# EAGLE design tulip breakout (EAGLE 9.6.2)
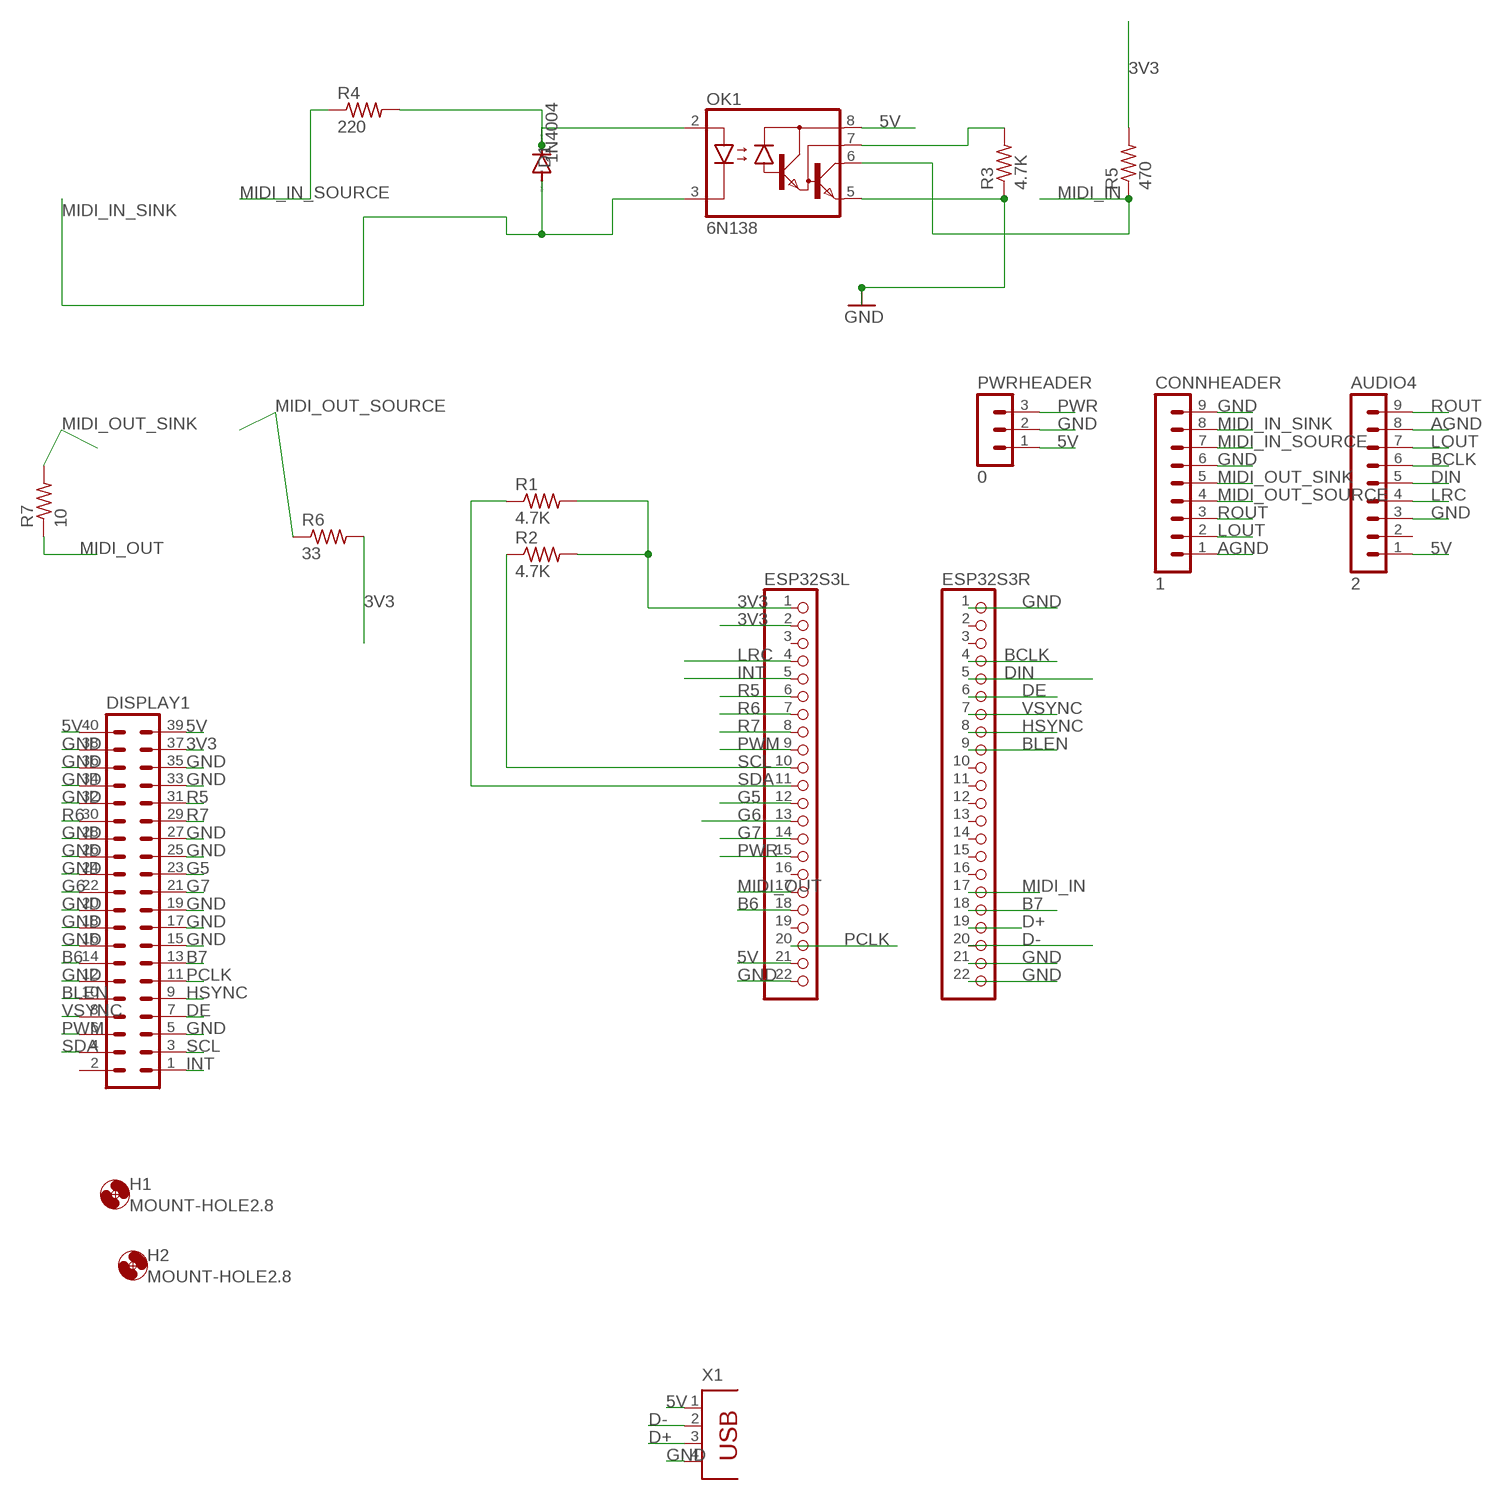
[diagram p0: schematic, sheet 1]

## Parts
AUDIO4  2  MA09-1  [MA09-1]
CONNHEADER  1  MA09-1  [MA09-1]
D1  1N4004  [DO41-10]
DISPLAY1  MA20-2  [MA20-2]
ESP32S3L  PINHD-1X22  [1X22]
ESP32S3R  PINHD-1X22  [1X22]
H1  MOUNT-HOLE2.8  [2,8]
H2  MOUNT-HOLE2.8  [2,8]
OK1  6N138  [DIL08]
PWRHEADER  0  MA03-1  [MA03-1]
R1  4.7K  R-US_0207/12  [0207/12]
R2  4.7K  R-US_0207/12  [0207/12]
R3  4.7K  R-US_0207/12  [0207/12]
R4  220  R-US_0207/12  [0207/12]
R5  470  R-US_0207/12  [0207/12]
R6  33  R-US_0207/12  [0207/12]
R7  10  R-US_0207/12  [0207/12]
X1  PN87520  [PN87520]

## Nets
3V3: DISPLAY1.37 ESP32S3L.1 ESP32S3L.2 R1.2 R2.2 R5.2 R6.2
5V: AUDIO4.1 DISPLAY1.39 DISPLAY1.40 ESP32S3L.21 OK1.8(VCC) PWRHEADER.1 X1.1
AGND: AUDIO4.8 CONNHEADER.1
B6: DISPLAY1.14 ESP32S3L.18
B7: DISPLAY1.13 ESP32S3R.18
BCLK: AUDIO4.6 ESP32S3R.4
BLEN: DISPLAY1.10 ESP32S3R.9
D+: ESP32S3R.19 X1.3
D-: ESP32S3R.20 X1.2
DE: DISPLAY1.7 ESP32S3R.6
DIN: AUDIO4.5 ESP32S3R.5
G5: DISPLAY1.23 ESP32S3L.12
G6: DISPLAY1.22 ESP32S3L.13
G7: DISPLAY1.21 ESP32S3L.14
GND: AUDIO4.3 CONNHEADER.6 CONNHEADER.9 DISPLAY1.5 DISPLAY1.12 DISPLAY1.15 DISPLAY1.16 DISPLAY1.17 DISPLAY1.18 DISPLAY1.19 DISPLAY1.20 DISPLAY1.24 DISPLAY1.25 DISPLAY1.26 DISPLAY1.27 DISPLAY1.28 DISPLAY1.32 DISPLAY1.33 DISPLAY1.34 DISPLAY1.35 DISPLAY1.36 DISPLAY1.38 ESP32S3L.22 ESP32S3R.1 ESP32S3R.21 ESP32S3R.22 OK1.5(GND) PWRHEADER.2 R3.1 X1.4
HSYNC: DISPLAY1.9 ESP32S3R.8
INT: DISPLAY1.1 ESP32S3L.5
LOUT: AUDIO4.7 CONNHEADER.2
LRC: AUDIO4.4 ESP32S3L.4
MIDI_IN: ESP32S3R.17 OK1.6(VO) R5.1
MIDI_IN_SINK: CONNHEADER.8 D1.A OK1.3(C)
MIDI_IN_SOURCE: CONNHEADER.7 R4.1
MIDI_OUT: ESP32S3L.17 R7.1
MIDI_OUT_SINK: CONNHEADER.5 R7.2
MIDI_OUT_SOURCE: CONNHEADER.4 R6.1
N$30: D1.C OK1.2(A) R4.2
N$32: OK1.7(VB) R3.2
PCLK: DISPLAY1.11 ESP32S3L.20
PWM: DISPLAY1.6 ESP32S3L.9
PWR: ESP32S3L.15 PWRHEADER.3
R5: DISPLAY1.31 ESP32S3L.6
R6: DISPLAY1.30 ESP32S3L.7
R7: DISPLAY1.29 ESP32S3L.8
ROUT: AUDIO4.9 CONNHEADER.3
SCL: DISPLAY1.3 ESP32S3L.10 R2.1
SDA: DISPLAY1.4 ESP32S3L.11 R1.1
VSYNC: DISPLAY1.8 ESP32S3R.7
Unconnected: AUDIO4.2 DISPLAY1.2 ESP32S3L.3 ESP32S3L.16 ESP32S3L.19 ESP32S3R.2 ESP32S3R.3 ESP32S3R.10 ESP32S3R.11 ESP32S3R.12 ESP32S3R.13 ESP32S3R.14 ESP32S3R.15 ESP32S3R.16

## Library data of the parts
AUDIO4 CONNHEADER = con-lstb:MA09-1: PIN HEADER; OC_FARNELL: unknown; OC_NEWARK: unknown
D1 = diode:1N4004: DIODE general purpose rectifier, 1 A
DISPLAY1 = con-lstb:MA20-2: PIN HEADER; OC_FARNELL: unknown; OC_NEWARK: unknown
ESP32S3L ESP32S3R = pinhead:PINHD-1X22: PIN HEADER
H1 H2 = holes:MOUNT-HOLE: MOUNTING HOLE with drill center marker
OK1 = optocoupler:6N138: MOTOROLA OPTO COUPLER; MF: VISHAY/TELEFUNKEN; MPN: 6N138; OC_FARNELL: 9860150; OC_NEWARK: 35K5294
PWRHEADER = con-lstb:MA03-1: PIN HEADER; OC_FARNELL: unknown; OC_NEWARK: unknown
R1-R7 = rcl:R-US_: RESISTOR, American symbol; SPICEPREFIX: R
X1 = con-berg:PN87520: BERG USB connector; OC_FARNELL: unknown; OC_NEWARK: unknown

## Board
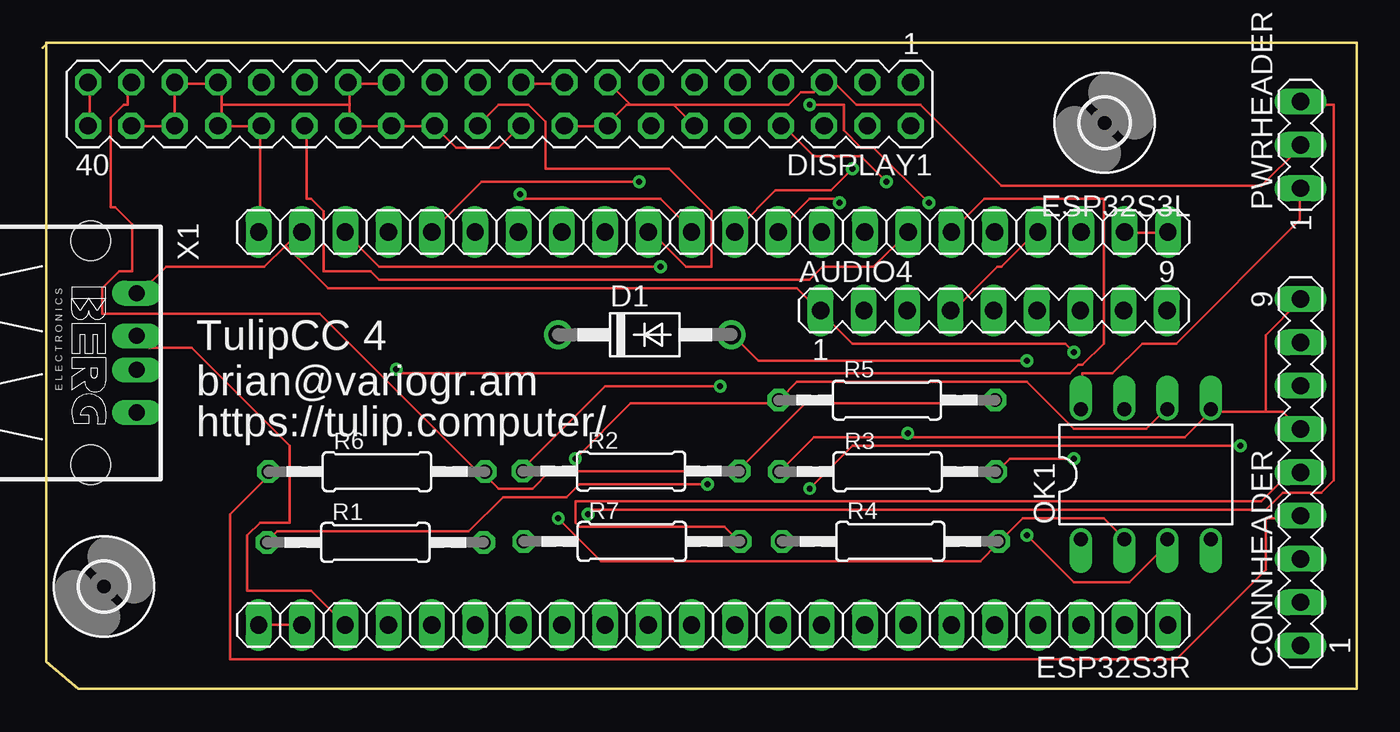
[diagram p1: board, top side]
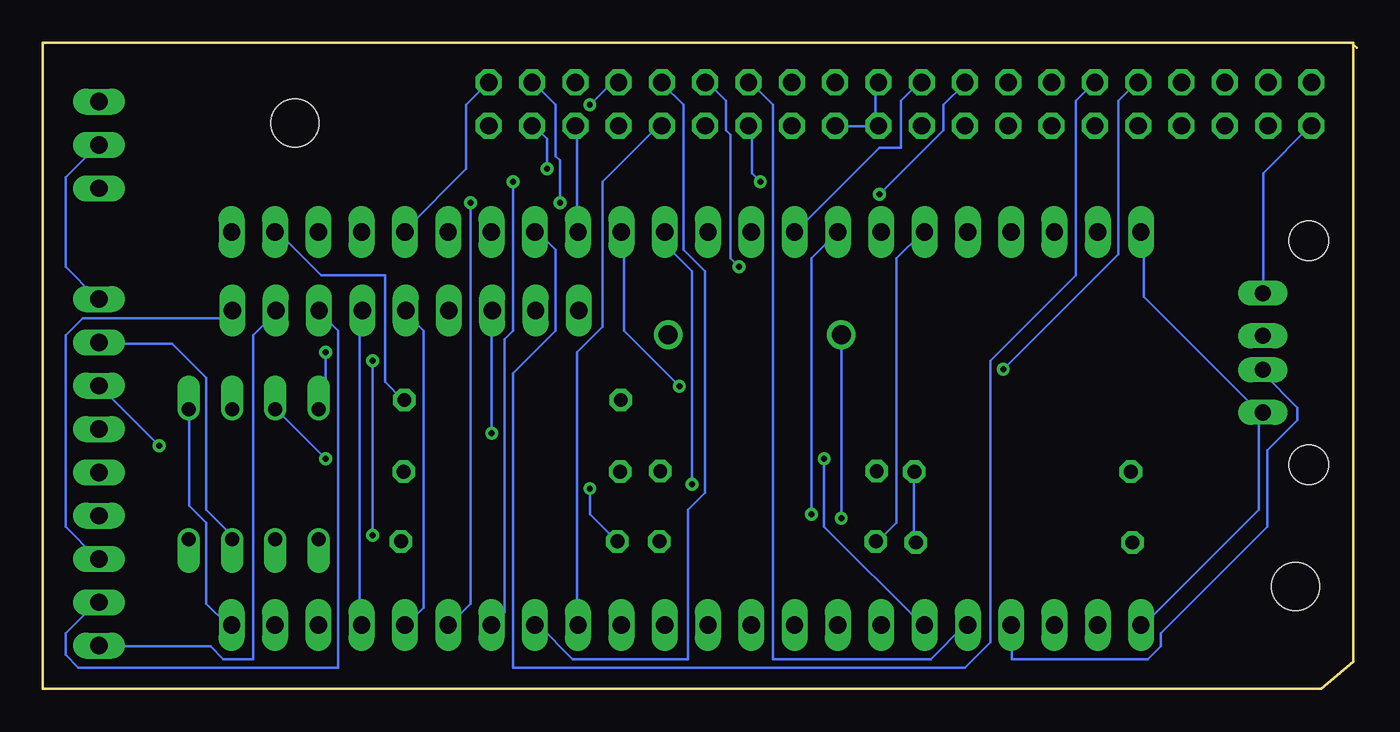
[diagram p2: board, bottom side, seen from below]

Size 77.1 x 37.9 mm. Coordinates in mm from the lower left corner, seen from the top.
Outline: 0.2,37.9 0.2,1.6 2.1,0 77.1,0 77.1,37.9 0.3,37.9 0,37.6
Copper layers (1*16): Top 0.035mm / dielectric 0.15mm / Bottom 0.035mm
Design rules "default *": minimum track width 6mil, minimum drill 0.35mm, track to track 10mil, track to pad 10mil, pad to pad 10mil, via to via 10mil, smd to smd 10mil, copper to edge 40mil, drill to drill 6mil, minimum pad ring 10mil, minimum via ring 8mil, stop-mask expansion 4mil, vias tented up to drill 0mil, thermal gap 10mil

### Footprints (pad centres in the part's own frame; a part is rotated, then mirrored left to right if it is on the bottom)
MA09-1 = drill 1.016 long: 1 -10.16,0; 2 -7.62,0; 3 -5.08,0; 4 -2.54,0; 5 0,0; 6 2.54,0; 7 5.08,0; 8 7.62,0; 9 10.16,0
DO41-10 = drill 1.118: A 5.08,0; C -5.08,0
MA20-2 = drill 1.016 octagon: 1 -24.13,-1.27; 2 -24.13,1.27; 3 -21.59,-1.27; 4 -21.59,1.27; 5 -19.05,-1.27; 6 -19.05,1.27; 7 -16.51,-1.27; 8 -16.51,1.27; 9 -13.97,-1.27; 10 -13.97,1.27; 11 -11.43,-1.27; 12 -11.43,1.27; 13 -8.89,-1.27; 14 -8.89,1.27; 15 -6.35,-1.27; 16 -6.35,1.27; 17 -3.81,-1.27; 18 -3.81,1.27; 19 -1.27,-1.27; 20 -1.27,1.27; 21 1.27,-1.27; 22 1.27,1.27; 23 3.81,-1.27; 24 3.81,1.27; 25 6.35,-1.27; 26 6.35,1.27; 27 8.89,-1.27; 28 8.89,1.27; 29 11.43,-1.27; 30 11.43,1.27; 31 13.97,-1.27; 32 13.97,1.27; 33 16.51,-1.27; 34 16.51,1.27; 35 19.05,-1.27; 36 19.05,1.27; 37 21.59,-1.27; 38 21.59,1.27; 39 24.13,-1.27; 40 24.13,1.27
1X22 = drill 1.016 long: 1 -26.67,0; 2 -24.13,0; 3 -21.59,0; 4 -19.05,0; 5 -16.51,0; 6 -13.97,0; 7 -11.43,0; 8 -8.89,0; 9 -6.35,0; 10 -3.81,0; 11 -1.27,0; 12 1.27,0; 13 3.81,0; 14 6.35,0; 15 8.89,0; 16 11.43,0; 17 13.97,0; 18 16.51,0; 19 19.05,0; 20 21.59,0; 21 24.13,0; 22 26.67,0
2,8 = hole 2.8: 0,0
DIL08 = drill 0.813 offset: 1 -3.81,-3.81; 2 -1.27,-3.81; 3 1.27,-3.81; 4 3.81,-3.81; 5 3.81,3.81; 6 1.27,3.81; 7 -1.27,3.81; 8 -3.81,3.81
MA03-1 = drill 1.016 long: 1 -2.54,0; 2 0,0; 3 2.54,0
0207/12 = drill 0.813 octagon: 1 -6.35,0; 2 6.35,0
PN87520 = drill 0.95 long: 1 -3.5,2.71; 2 -1,2.71; 3 1,2.71; 4 3.5,2.71 | hole 2.3: -6.57,0; 6.57,0

### Placement (x,y rotation side)
AUDIO4  55.8,22.2 0 top
CONNHEADER  73.8,12.7 90 top
D1  35.32,20.77 0 top
DISPLAY1  26.8,34.3 180 top
ESP32S3L  39.34,26.8 180 top
ESP32S3R  39.34,3.75 180 top
H1  3.6,6 0 top
H2  62.3,33.2 0 top
OK1  64.72,12.58 0 top
PWRHEADER  73.8,31.9 90 top
R1  19.52,8.59 0 top
R2  34.52,12.77 0 top
R3  49.57,12.74 0 top
R4  49.73,8.65 0 top
R5  49.53,16.94 0 top
R6  19.61,12.74 0 top
R7  34.57,8.65 0 top
X1  2.81,19.71 270 top

### Tracks (layer width: path | path; a pad name or v marks a point on that pad's centre or on a via)
3V3
  Top 0.152: ESP32S3L.2 63.5,26.75 66,26.75 ESP32S3L.1 | R5.2 55.75,16.75 44.75,16.75 41,13 R2.2 40.75,12.75 29.75,12.75 28.75,11.75 26.75,11.75 26,12.5 R6.2 25.75,12.75 25.5,12.75 16.25,22 3.5,22 3.5,23.5 4.5,24.5 5.25,24.5 5.25,27.25 4.25,28.25 4,28.25 4,33.5 4.75,34.25 5,34.25 5,35.5 DISPLAY1.37
  Bottom 0.152: ESP32S3L.2 63.25,26.75 60.75,24.25 57,24.25 57,18 56,17 R5.2 | R1.2 26,8.75 26,12.5 R6.2
5V  (via drill 0.35)
  Top 0.152: OK1.8 61,16.5 61,18.5 62.75,18.5 64.5,20.25 66.5,20.25 73.75,27.5 73.75,29.25 PWRHEADER.1 | DISPLAY1.40 2.75,33.25 2.75,35.5 DISPLAY1.39 | 14.25,26 15,26.75 ESP32S3L.21 | 14.25,26 13,24.75 7.25,24.75 5.75,23.25 X1.1 | 14.25,26 16.75,23.5 44.25,23.5 45.5,22.25 AUDIO4.1 45.75,22 47.5,20.25 60,20.25 v60.5,19.75
  Bottom 0.152: DISPLAY1.40 2.75,33 5.5,30.25 5.5,23.25 X1.1 | v60.5,19.75 60.5,16.75 60.75,16.5 OK1.8
AGND
  Bottom 0.152: CONNHEADER.1 73.75,2.5 67.25,2.5 66.5,1.75 64.75,1.75 64.75,20.75 63.5,22 AUDIO4.8
B6  (via drill 0.35)
  Top 0.152: v35,29.75 25.75,29.75 23,27 ESP32S3L.18
  Bottom 0.152: v35,29.75 35.5,30.25 35.5,33 DISPLAY1.14
B7
  Bottom 0.152: ESP32S3R.18 23,3.75 25,1.75 34.25,1.75 34.25,34.25 35.5,35.5 DISPLAY1.13
BCLK
  Bottom 0.152: ESP32S3R.4 58.5,3.75 58.5,22 AUDIO4.6
BLEN
  Bottom 0.152: ESP32S3R.9 45.75,3.75 45.75,19.75 44.25,21.25 44.25,29.75 41,33 DISPLAY1.10
D+
  Bottom 0.152: X1.3 5.5,18.5 3.5,16.5 3.5,15.75 5.25,14 5.25,9.5 11.5,3.25 11.5,2.5 12.25,1.75 20.25,1.75 20.25,3.75 ESP32S3R.19
D-
  Top 0.152: ESP32S3R.20 15.75,5.75 12,5.75 12,9 12.75,9.75 14.5,9.75 14.5,14.25 8.75,20 6.25,20 5.75,20.5 X1.2
DE  (via drill 0.35)
  Top 0.152: v52,28.5 48.75,31.75 48,31.75 47,32.75 47,34.25 v45,34.25
  Bottom 0.152: v52,28.5 52,5 53.25,3.75 ESP32S3R.6 | v45,34.25 43.5,35.75 DISPLAY1.7
DIN
  Bottom 0.152: AUDIO4.5 55.75,22 54.75,21 54.75,4.75 55.75,3.75 ESP32S3R.5
G5  (via drill 0.35)
  Top 0.152: v28,29 28.25,28.75 36.25,28.75 38,27 ESP32S3L.12
  Bottom 0.152: v28,29 24.25,32.75 24.25,34.25 23,35.5 DISPLAY1.23
G6
  Top 0.152: DISPLAY1.22 26.75,34.25 28.5,34.25 29.5,33.25 29.5,30.5 36.75,30.5 39.25,28 39.25,24.75 37.75,24.75 35.75,26.75 ESP32S3L.13
G7
  Bottom 0.152: ESP32S3L.14 32.75,27 28,31.75 26.75,31.75 26.75,34.5 25.75,35.5 DISPLAY1.21
GND  (via drill 0.35)
  Top 0.152: 50.75,14.75 67,14.75 68.5,16.25 OK1.5 68.75,16.25 71.75,16.25 | 50.75,14.75 45.25,14.75 43.25,12.75 R3.1 | 71.75,16.25 72.75,16.25 73.75,15.25 CONNHEADER.6 | 50.75,14.75 v50.75,15 | 71.75,16.25 71.75,20.75 73.75,22.75 CONNHEADER.9 | DISPLAY1.19 28.25,35.5 30.5,35.5 DISPLAY1.17 | DISPLAY1.18 30.75,33 33,33 DISPLAY1.16 33.25,33.25 34.25,34.25 34.5,34.25 | 37,34.25 38,33.25 DISPLAY1.12 | 34.5,34.25 37,34.25 | 34.5,34.25 33.25,35.5 DISPLAY1.15 | 37,34.25 43.75,34.25 44.5,35 45.25,35 45.75,35.5 DISPLAY1.5 46,35.5 46.5,35.5 47.75,34.25 51.5,34.25 56.25,29.5 71.5,29.5 73.75,31.75 PWRHEADER.2 | 18,35.5 20.25,35.5 DISPLAY1.25 | 18,34.25 18,33.25 DISPLAY1.28 18,33 20.25,33 DISPLAY1.26 20.5,33 22.75,33 DISPLAY1.24 23,33 24.25,31.75 26.75,31.75 28,33 DISPLAY1.20 | 18,34.25 18,35.5 | 18,35.5 DISPLAY1.27 | DISPLAY1.38 5.25,33 7.75,33 DISPLAY1.36 7.75,35.5 | 12.75,33 10.5,33 DISPLAY1.34 10.5,33.25 10.5,34.25 | 10.5,34.25 10.5,35.5 DISPLAY1.33 10.25,35.5 7.75,35.5 | 7.75,35.5 DISPLAY1.35 | 10.5,34.25 18,34.25 | ESP32S3R.21 ESP32S3R.22 | 12.75,33 12.75,27 ESP32S3L.22 | 12.75,33 DISPLAY1.32
  Bottom 0.152: ESP32S3R.1 66.25,3.75 67.5,5 67.5,9.75 68.5,10.75 68.5,16.25 OK1.5 | v50.75,15 50.75,22 AUDIO4.3 | PWRHEADER.2 74,31.75 75.75,30 75.75,24.75 74,23 CONNHEADER.9 | DISPLAY1.18 30.5,33 28.25,33 DISPLAY1.20 28.25,33.25 28.25,35.5 DISPLAY1.19 | ESP32S3L.22 12.5,26.75 12.5,23 5.75,16.25 X1.4 5.75,16 5.75,10.5 12.5,3.75 ESP32S3R.22
HSYNC
  Bottom 0.152: ESP32S3R.8 48,3.75 46,1.75 39.25,1.75 39.25,10.5 38.25,11.5 38.25,24.5 39.5,25.75 39.5,34.25 40.75,35.5 DISPLAY1.9
INT
  Bottom 0.152: DISPLAY1.1 52.25,34.25 52.25,30.5 55.75,27 ESP32S3L.5
LOUT
  Bottom 0.152: CONNHEADER.2 74,5 75.75,3.25 75.75,2 75,1.25 59.75,1.25 59.75,21 60.75,22 AUDIO4.7
LRC
  Top 0.152: AUDIO4.4 53.5,22.25 56,24.75 56.25,24.75 58.25,26.75 ESP32S3L.4
MIDI_IN  (via drill 0.35)
  Top 0.152: OK1.6 65.75,16.25 64.75,15.25 60.5,15.25 57.75,18 44.25,18 43.25,17 R5.1 43,16.75 34.5,16.75 v31.25,13.5
  Bottom 0.152: v31.25,13.5 31.25,9.5 25.5,3.75 ESP32S3R.17
MIDI_IN_SINK  (via drill 0.35)
  Top 0.152: v57.75,19.25 42,19.25 40.5,20.75 D1.A | v57.75,9 60.5,6.25 63.75,6.25 65.75,8.25 65.75,8.75 OK1.3
  Bottom 0.152: OK1.3 66,9 67.5,10.5 67.5,18.25 69.5,20.25 73.75,20.25 CONNHEADER.8 | v57.75,9 v57.75,19.25
MIDI_IN_SOURCE  (via drill 0.35)
  Top 0.152: v45,11.75 47.5,14.25 v70.25,14.25
  Bottom 0.152: v45,11.75 45,10.25 43.5,8.75 R4.1 | v70.25,14.25 73.75,17.75 CONNHEADER.7
MIDI_OUT
  Bottom 0.152: R7.1 28,8.75 27,9.75 27,25.25 25.5,26.75 ESP32S3L.17
MIDI_OUT_SINK
  Top 0.152: R7.2 40.75,8.75 40,9.5 31.5,9.5 31.25,9.75 31.25,11 71.5,11 73,12.5 73.75,12.5 CONNHEADER.5
MIDI_OUT_SOURCE
  Top 0.152: R6.1 13.25,12.5 11,10.25 11,1.75 66.5,1.75 71.75,7 71.75,10 73.75,10 CONNHEADER.4
N$30  (via drill 0.35)
  Top 0.152: OK1.2 63.25,9 62.25,10 57.5,10 56.25,8.75 R4.2 56,8.5 55,7.5 32.75,7.5 v30.25,10
  Bottom 0.152: v30.25,10 30.25,20.75 D1.C
N$32  (via drill 0.35)
  Top 0.152: v60.5,13.5 56.75,13.5 56,12.75 R3.2
  Bottom 0.152: v60.5,13.5 63.25,16.25 OK1.7
PCLK  (via drill 0.35)
  Top 0.152: v36.25,24.75 19.75,24.75 17.75,26.75 ESP32S3L.20
  Bottom 0.152: v36.25,24.75 36.75,25.25 36.75,32.5 37,32.75 37,34.5 38,35.5 DISPLAY1.11
PWM
  Bottom 0.152: ESP32S3L.9 45.75,27 45.75,33 DISPLAY1.6
PWR  (via drill 0.35)
  Top 0.152: v32,10.25 32.25,10.5 71.75,10.5 72.75,11.5 75,11.5 75.75,12.25 75.75,34.25 74,34.25 PWRHEADER.3
  Bottom 0.152: ESP32S3L.15 32,25.25 v32,10.25
R5  (via drill 0.35)
  Top 0.152: v20.75,18.75 21,18.5 60.25,18.5 60.75,19 61,19 62.25,20.25 62.25,28.75 55.25,28.75 53.5,27 ESP32S3L.6
  Bottom 0.152: v20.75,18.75 14,25.5 14,34.5 13,35.5 DISPLAY1.31
R6
  Top 0.152: DISPLAY1.30 15.5,33 15.5,28.75 15.75,28.75 16.5,28 16.5,24.5 19.25,24.5 19.75,24 45,24 45.75,24.75 48.75,24.75 50.75,26.75 ESP32S3L.7
R7
  Bottom 0.152: DISPLAY1.29 15.5,35.5 16.5,34.5 16.5,24.25 21.5,19.25 21.5,2.75 23,1.25 49.5,1.25 49.5,18.5 47,21 47,25.75 48,26.75 ESP32S3L.8
ROUT
  Bottom 0.152: CONNHEADER.3 74,7.75 75.75,9.5 75.75,20.75 74.75,21.75 66,21.75 66,22 AUDIO4.9
SCL  (via drill 0.35)
  Top 0.152: v39.75,17.75 33,17.75 28.25,13 R2.1 | v46.75,28.5 46.5,28.75 45,28.75 43.25,27 ESP32S3L.10
  Bottom 0.152: v39.75,17.75 43,21 43,26.75 ESP32S3L.10 | v46.75,28.5 46.75,31 47,31.25 47,34.25 48.25,35.5 DISPLAY1.3
SDA  (via drill 0.35)
  Top 0.152: v39,12 31.5,12 30.75,11.25 27,11.25 25,9.25 13.75,9.25 13.25,8.75 R1.1 | v47.5,30.5 46.25,29.25 43,29.25 40.75,27 ESP32S3L.11
  Bottom 0.152: v39,12 39,24.5 40.5,26 40.5,26.75 ESP32S3L.11 | v47.5,30.5 47.5,32.25 48.25,33 DISPLAY1.4
VSYNC  (via drill 0.35)
  Top 0.152: v49.5,29.75 48,31.25 45.25,31.25 43.5,33 DISPLAY1.8
  Bottom 0.152: v49.5,29.75 49.5,21 50,20.5 50,4.5 50.75,3.75 ESP32S3R.7

### Text on the board
tPlace: TulipCC 4 / brian@variogr.am | https://tulip.computer/